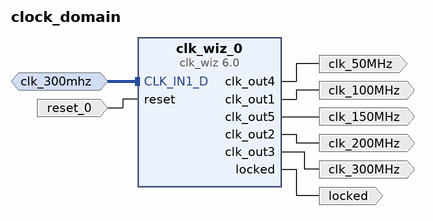
[diagram p0: block diagram of the top level]
# Vivado block design clock_domain, xczu7ev-ffvc1156-2-e, Vivado 2019.2
create_bd_design clock_domain

create_bd_intf_port -mode Slave -vlnv xilinx.com:interface:diff_clock_rtl:1.0 clk_300mhz
set_property -dict {CONFIG.FREQ_HZ 300000000} [get_bd_intf_ports clk_300mhz]
create_bd_port -dir O -type clk clk_100MHz
set_property -dict {CONFIG.FREQ_HZ 100000000} [get_bd_ports clk_100MHz]
create_bd_port -dir O locked
create_bd_port -dir I -type rst reset_0
set_property -dict {CONFIG.POLARITY ACTIVE_HIGH} [get_bd_ports reset_0]
create_bd_port -dir O -type clk clk_200MHz
set_property -dict {CONFIG.FREQ_HZ 200000000} [get_bd_ports clk_200MHz]
create_bd_port -dir O -type clk clk_300MHz
set_property -dict {CONFIG.FREQ_HZ 300000000} [get_bd_ports clk_300MHz]
create_bd_port -dir O -type clk clk_50MHz
set_property -dict {CONFIG.FREQ_HZ 50000000} [get_bd_ports clk_50MHz]
create_bd_port -dir O -type clk clk_150MHz
set_property -dict {CONFIG.FREQ_HZ 150000000} [get_bd_ports clk_150MHz]

create_bd_cell -type ip -vlnv xilinx.com:ip:clk_wiz:6.0 clk_wiz_0
set_property -dict [list \
  CONFIG.CLKIN1_JITTER_PS 33.330000000000005 \
  CONFIG.CLKOUT1_JITTER 101.475 \
  CONFIG.CLKOUT1_PHASE_ERROR 77.836 \
  CONFIG.CLKOUT1_REQUESTED_OUT_FREQ 100.0 \
  CONFIG.CLKOUT2_JITTER 88.577 \
  CONFIG.CLKOUT2_PHASE_ERROR 77.836 \
  CONFIG.CLKOUT2_REQUESTED_OUT_FREQ 200.0 \
  CONFIG.CLKOUT2_USED true \
  CONFIG.CLKOUT3_JITTER 81.814 \
  CONFIG.CLKOUT3_PHASE_ERROR 77.836 \
  CONFIG.CLKOUT3_REQUESTED_OUT_FREQ 300.0 \
  CONFIG.CLKOUT3_USED true \
  CONFIG.CLKOUT4_JITTER 116.415 \
  CONFIG.CLKOUT4_PHASE_ERROR 77.836 \
  CONFIG.CLKOUT4_REQUESTED_OUT_FREQ 50.000 \
  CONFIG.CLKOUT4_USED true \
  CONFIG.CLKOUT5_JITTER 93.717 \
  CONFIG.CLKOUT5_PHASE_ERROR 77.836 \
  CONFIG.CLKOUT5_REQUESTED_OUT_FREQ 150.000 \
  CONFIG.CLKOUT5_USED true \
  CONFIG.CLK_IN1_BOARD_INTERFACE clk_300mhz \
  CONFIG.MMCM_CLKFBOUT_MULT_F 4.000 \
  CONFIG.MMCM_CLKIN1_PERIOD 3.333 \
  CONFIG.MMCM_CLKIN2_PERIOD 10.0 \
  CONFIG.MMCM_CLKOUT0_DIVIDE_F 12.000 \
  CONFIG.MMCM_CLKOUT1_DIVIDE 6 \
  CONFIG.MMCM_CLKOUT2_DIVIDE 4 \
  CONFIG.MMCM_CLKOUT3_DIVIDE 24 \
  CONFIG.MMCM_CLKOUT4_DIVIDE 8 \
  CONFIG.NUM_OUT_CLKS 5 \
  CONFIG.PRIM_SOURCE Differential_clock_capable_pin \
  CONFIG.RESET_BOARD_INTERFACE Custom \
  CONFIG.USE_BOARD_FLOW true \
  CONFIG.USE_RESET true \
] [get_bd_cells clk_wiz_0]

# ---- connections ----

connect_bd_intf_net [get_bd_intf_ports clk_300mhz] [get_bd_intf_pins clk_wiz_0/CLK_IN1_D]
connect_bd_net [get_bd_pins clk_wiz_0/clk_out1] [get_bd_ports clk_100MHz]
connect_bd_net [get_bd_pins clk_wiz_0/locked] [get_bd_ports locked]
connect_bd_net -net reset_0_1 [get_bd_ports reset_0] [get_bd_pins clk_wiz_0/reset]
connect_bd_net [get_bd_pins clk_wiz_0/clk_out2] [get_bd_ports clk_200MHz]
connect_bd_net [get_bd_pins clk_wiz_0/clk_out3] [get_bd_ports clk_300MHz]
connect_bd_net [get_bd_pins clk_wiz_0/clk_out4] [get_bd_ports clk_50MHz]
connect_bd_net [get_bd_pins clk_wiz_0/clk_out5] [get_bd_ports clk_150MHz]

validate_bd_design
save_bd_design
